# Altium schematic sheet Mainboard_V1.0_HMI.SchDoc: Mainboard
size A4; PageSetup: Record=PageOptions|CenterHorizontal=True|CenterVertical=True|PrintScale=0.97|XCorrection=1.00|YCorrection=1.00|PrintKind=0|BorderSize=5000000|LeftOffset=0|BottomOffset=0|Orientation=2|PaperLength=1000|PaperWidth=1000|Scale=100|PaperSource=7|PrintQuality=-3|MediaType=1|DitherType=10|PrintScaleMode=1|PaperKind=A4|PaperIndex=9; Organization: Ostschweizer Fachhochschule; Address2: Florian Baumgartner & Thierry Schwaller; Address3: florian.baumgartner@ost.ch; DocumentNumber: 6; Revision: V1.0; SheetNumber: 6; SheetTotal: 7; Author: Florian Baumgartner & Alain Keller; Subtitle: HMI
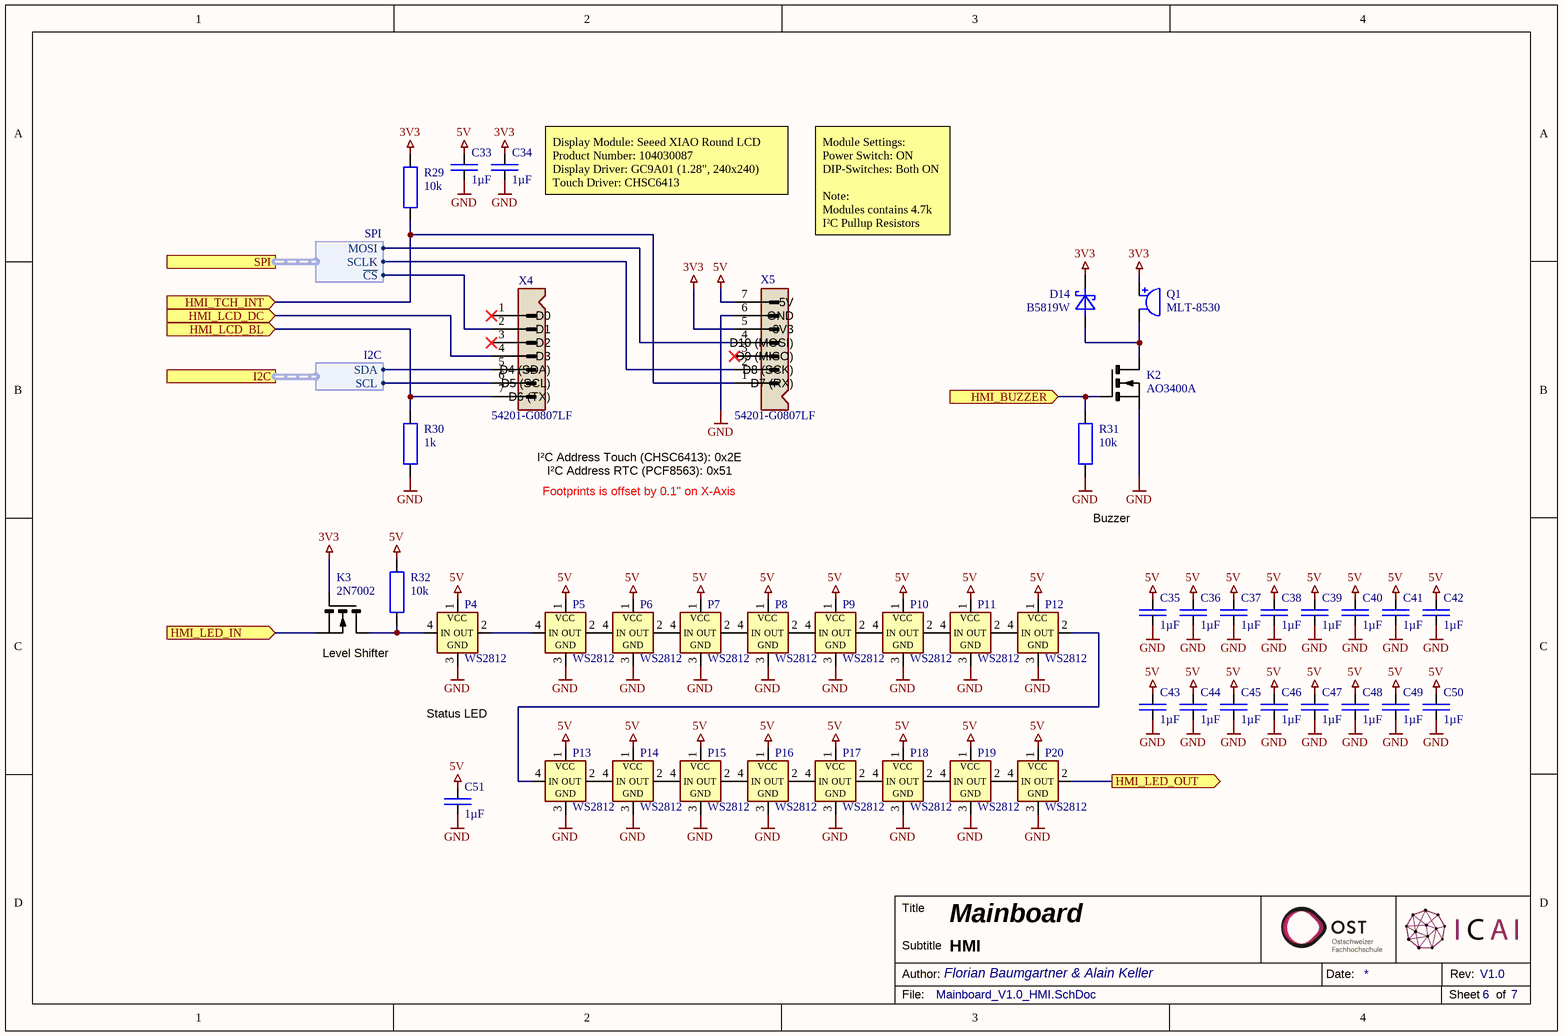
[diagram p0: Mainboard_V1.0_HMI.SchDoc]

## Parts
C33  1µF  [SMD Keramikkondensator 0603]
C34  1µF  [SMD Keramikkondensator 0603]
C35  1µF  [SMD Keramikkondensator 0603]
C36  1µF  [SMD Keramikkondensator 0603]
C37  1µF  [SMD Keramikkondensator 0603]
C38  1µF  [SMD Keramikkondensator 0603]
C39  1µF  [SMD Keramikkondensator 0603]
C40  1µF  [SMD Keramikkondensator 0603]
C41  1µF  [SMD Keramikkondensator 0603]
C42  1µF  [SMD Keramikkondensator 0603]
C43  1µF  [SMD Keramikkondensator 0603]
C44  1µF  [SMD Keramikkondensator 0603]
C45  1µF  [SMD Keramikkondensator 0603]
C46  1µF  [SMD Keramikkondensator 0603]
C47  1µF  [SMD Keramikkondensator 0603]
C48  1µF  [SMD Keramikkondensator 0603]
C49  1µF  [SMD Keramikkondensator 0603]
C50  1µF  [SMD Keramikkondensator 0603]
C51  1µF  [SMD Keramikkondensator 0603]
D14  B5819W  [SMD Diode SOD-123]
K2  AO3400A  [SMD MOSFET SOT-23]
K3  2N7002  [SMD MOSFET SOT-23]
P4  WS2812  [SMD LED WS2812B-0807]
P5  WS2812  [SMD LED WS2812B-0807]
P6  WS2812  [SMD LED WS2812B-0807]
P7  WS2812  [SMD LED WS2812B-0807]
P8  WS2812  [SMD LED WS2812B-0807]
P9  WS2812  [SMD LED WS2812B-0807]
P10  WS2812  [SMD LED WS2812B-0807]
P11  WS2812  [SMD LED WS2812B-0807]
P12  WS2812  [SMD LED WS2812B-0807]
P13  WS2812  [SMD LED WS2812B-0807]
P14  WS2812  [SMD LED WS2812B-0807]
P15  WS2812  [SMD LED WS2812B-0807]
P16  WS2812  [SMD LED WS2812B-0807]
P17  WS2812  [SMD LED WS2812B-0807]
P18  WS2812  [SMD LED WS2812B-0807]
P19  WS2812  [SMD LED WS2812B-0807]
P20  WS2812  [SMD LED WS2812B-0807]
Q1  MLT-8530  [SMD Buzzer (MLT-8530)]
R29  10k  [SMD Widerstand 0603]
R30  1k  [SMD Widerstand 0603]
R31  10k  [SMD Widerstand 0603]
R32  10k  [SMD Widerstand 0603]
X4  54201-G0807LF  [SMD Pin-Header 1x7]
X5  54201-G0807LF  [SMD Pin-Header 1x7]

## Ports
HMI_BUZZER (in), HMI_LCD_BL (in), HMI_LCD_DC (in), HMI_LED_IN (in), HMI_LED_OUT (out), HMI_TCH_INT (in), I2C (harness I2C), SPI (harness SPI)

## Harnesses
SPI: SCLK, MOSI, ~{CS}
I2C: SCL, SDA

## Nets
3V3: C34.2 D14.K K3.G Q1.1(P) R29.2 X5.5
5V: C33.2 C35.2 C36.2 C37.2 C38.2 C39.2 C40.2 C41.2 C42.2 C43.2 C44.2 C45.2 C46.2 C47.2 C48.2 C49.2 C50.2 C51.2 P4.1(VCC) P5.1(VCC) P6.1(VCC) P7.1(VCC) P8.1(VCC) P9.1(VCC) P10.1(VCC) P11.1(VCC) P12.1(VCC) P13.1(VCC) P14.1(VCC) P15.1(VCC) P16.1(VCC) P17.1(VCC) P18.1(VCC) P19.1(VCC) P20.1(VCC) R32.2 X5.7
GND: C33.1 C34.1 C35.1 C36.1 C37.1 C38.1 C39.1 C40.1 C41.1 C42.1 C43.1 C44.1 C45.1 C46.1 C47.1 C48.1 C49.1 C50.1 C51.1 K2.S P4.3(GND) P5.3(GND) P6.3(GND) P7.3(GND) P8.3(GND) P9.3(GND) P10.3(GND) P11.3(GND) P12.3(GND) P13.3(GND) P14.3(GND) P15.3(GND) P16.3(GND) P17.3(GND) P18.3(GND) P19.3(GND) P20.3(GND) R30.1 R31.1 X5.6
HMI_BUZZER: K2.G R31.2 ; port HMI_BUZZER
HMI_LCD_BL: R30.2 X4.7 ; port HMI_LCD_BL
HMI_LCD_DC: X4.4 ; port HMI_LCD_DC
HMI_LED_IN: K3.S ; port HMI_LED_IN
HMI_LED_OUT: P20.2(OUT) ; port HMI_LED_OUT
HMI_TCH_INT: R29.1 X5.1 ; port HMI_TCH_INT
NetD14_A: D14.A K2.D Q1.2(M)
NetK3_D: K3.D P4.4(IN) R32.1
NetP4_2: P4.2(OUT) P5.4(IN)
NetP5_2: P5.2(OUT) P6.4(IN)
NetP6_2: P6.2(OUT) P7.4(IN)
NetP7_2: P7.2(OUT) P8.4(IN)
NetP8_2: P8.2(OUT) P9.4(IN)
NetP9_2: P9.2(OUT) P10.4(IN)
NetP10_2: P10.2(OUT) P11.4(IN)
NetP11_2: P11.2(OUT) P12.4(IN)
NetP12_2: P12.2(OUT) P13.4(IN)
NetP13_2: P13.2(OUT) P14.4(IN)
NetP14_2: P14.2(OUT) P15.4(IN)
NetP15_2: P15.2(OUT) P16.4(IN)
NetP16_2: P16.2(OUT) P17.4(IN)
NetP17_2: P17.2(OUT) P18.4(IN)
NetP18_2: P18.2(OUT) P19.4(IN)
NetP19_2: P19.2(OUT) P20.4(IN)
NetX4_2: X4.2 ; port SPI.~{CS}
NetX4_5: X4.5 ; port I2C.SDA
NetX4_6: X4.6 ; port I2C.SCL
NetX5_2: X5.2 ; port SPI.SCLK
NetX5_4: X5.4 ; port SPI.MOSI

Not connected (* = marked no-connect by the designer): X4 1* 3*; X5 3*

## Notes on the sheet
- (near C34) Display Module: Seeed XIAO Round LCD
  Product Number: 104030087
  Display Driver: GC9A01 (1.28", 240x240)
  Touch Driver: CHSC6413
- Module Settings:
  Power Switch: ON
  DIP-Switches: Both ON
  Note:
  Modules contains 4.7k I²C Pullup Resistors
- (near X4) D0
- (near X5) 5V
- (near X5) GND
- (near X4) D1
- (near X4) D2
- (near X4) D3
- (near X4) D4 (SDA)
- (near X4) D5 (SCL)
- (near X5) D7 (RX)
- (near X5) D8 (SCK)
- (near X5) D9 (MISO)
- (near X5) D10 (MOSI)
- (near X5) 3V3
- (near X4) D6 (TX)
- I²C Address RTC (PCF8563): 0x51
- I²C Address Touch (CHSC6413): 0x2E
- Footprints is offset by 0.1" on X-Axis
- (near R31) Buzzer
- (near K3) Level Shifter
- Status LED
- Title
- Author:
- Subtitle
- Date:
- Rev:
- File:
- Sheet
- of

## Library data of the parts
C33-C51 = C-CAPACITOR: CAP-MK; Component Description: Multilayer Ceramic Capacitors; Component Value: 1µF 50V; Digikey: 1276-1860-1-ND; Farnell: 3013383; Mouser: 187-CL10A105KB8NNNC; JLC-Parts: C15849; Unit Price: 0.01
D14 = R-DIODE:SCHKY: S-DIODE; Component Description: Low Voltage Schottky-Diode; Mouser: 833-B5819W-TP; Farnell: 2306459; Digikey: B5819W-TPMSCT-ND; JLC-Parts: C8598; Component Value: B5819W; Unit Price: 0.03
K2 K3 = K-FET:NIGE: MOSFET N-Channel; ComponentLink1Description: Datasheet; Component Description: MOSFET N-Channel
  K2: Digikey: 785-1000-1-ND; ComponentLink1URL: http://www.aosmd.com/pdfs/datasheet/AO3400A.pdf; Component Value: AO3400A; JLC-Parts: C20917; Unit Price: 0.20
  K3: Digikey: 2N7002NCT-ND; Farnell: 1713823; Mouser: 512-2N7002; ComponentLink1URL: https://datasheet.lcsc.com/lcsc/1810151612_Jiangsu-Changjing-Electronics-Technology-Co---Ltd--2N7002_C8545.pdf; Component Value: 2N7002; JLC-Parts: C8545; Unit Price: 0.02
P4-P20 = P-WS2812B-0807: Smart RGB-LED; aliExpress: 1005003999865721; Component Value: XL-0807RGBC-WS2812B; JLC-Parts: C3646929; ComponentLink1Description: Datasheet; ComponentLink1URL: https://datasheet.lcsc.com/lcsc/2108251530_OPSCO-Optoelectronics-SK6812D-EC3210R_C2890041.pdf; Component Description: Smart RGB-LED; Unit Price: 0.07
Q1 = Q-Buzzer: Electromagnetic Buzzer; Digikey: 458-1052-ND; Farnell: 1801084; Mouser: 539-AST200Q; JLC-Parts: C94599; ComponentLink1Description: Datasheet; ComponentLink1URL: https://datasheet.lcsc.com/lcsc/1811151451_Jiangsu-Huaneng-Elec-MLT-8530_C94599.pdf; Component Description: Electromagnetic Buzzer; Component Value: MLT-8530; Unit Price: 0.27
R29 R31 R32 = R-RESISTOR: RES (E=Heizwiderstand B=Messwandler); Component Description: Thick Film Chip Resistor; Component Value: 10k (75V, 100mW, 1%); Digikey: P10.0KHCT-ND; Farnell: 2303192; Mouser: 667-ERJ-3EKF1002V; JLC-Parts: C25804; Unit Price: 0.01
R30 = R-RESISTOR: RES (E=Heizwiderstand B=Messwandler); Component Description: Dickschicht Chipwiderstand; Component Value: 1k (75V, 100mW, 1%); Digikey: P1.00KHCT-ND; Farnell: 2303145; Mouser: 667-ERJ-3EKF1001V; JLC-Parts: C21190; Unit Price: 0.01
X4 X5 = X-Stiftleiste (7-Fach): Component Description: Pin Header SMD; Digikey: 609-54201-G0807LF-ND; Mouser: 649-54201-G0807ALF; ComponentLink1Description: Datasheet; ComponentLink1URL: https://cdn.amphenol-cs.com/media/wysiwyg/files/documentation/datasheet/boardwiretoboard/bwb_bergstik.pdf; Component Value: 54201-G0807LF; Unit Price: 1.32